# Altium schematic sheet MCU.SchDoc
size A3; SheetNumber: 2; SheetTotal: 2
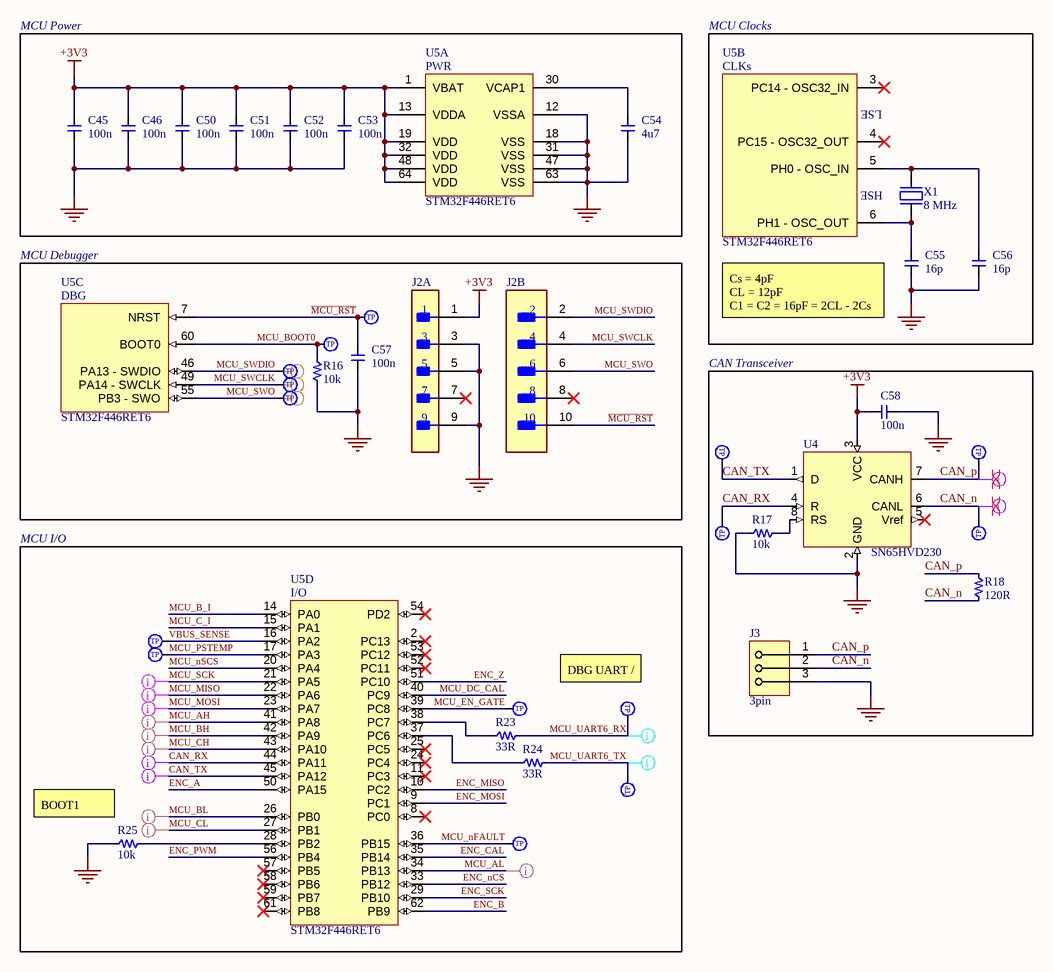
[diagram p0: MCU.SchDoc]

## Parts
C45  100n  [C0402]
C46  100n  [C0402]
C50  100n  [C0402]
C51  100n  [C0402]
C52  100n  [C0402]
C53  100n  [C0402]
C54  4u7  [C0402]
C55  16p  [C0402]
C56  16p  [C0402]
C57  100n  [C0402]
C58  100n  [C0402]
J2  FTSH-105-01-L-DV-K-TR  [FP-FTSH-105-01-L-DV-K-TR-MFG]  (value not drawn)  (parts A,B of 2)
J3  3pin  [3pin_ftp]  (no BOM)
R16  10k  [R0402]
R17  10k  [R0402]
R18  120R  [R0603]
R23  33R  [R0402]
R24  33R  [R0402]
R25  10k  [R0402]
TP14  Testing_Point_1mm  [TestingPoint_1mm]  (value not drawn)  (no BOM)
TP15  Testing_Point_1mm  [TestingPoint_1mm]  (value not drawn)  (no BOM)
TP16  Testing_Point_1mm  [TestingPoint_1mm]  (value not drawn)  (no BOM)
TP17  Testing_Point_1mm  [TestingPoint_1mm]  (value not drawn)  (no BOM)
TP18  Testing_Point_1mm  [TestingPoint_1mm]  (value not drawn)  (no BOM)
TP19  Testing_Point_1mm  [TestingPoint_1mm]  (value not drawn)  (no BOM)
TP20  Testing_Point_1mm  [TestingPoint_1mm]  (value not drawn)  (no BOM)
TP21  Testing_Point_1mm  [TestingPoint_1mm]  (value not drawn)  (no BOM)
TP22  Testing_Point_1mm  [TestingPoint_1mm]  (value not drawn)  (no BOM)
TP25  Testing_Point_1mm  [TestingPoint_1mm]  (value not drawn)  (no BOM)
TP26  Testing_Point_1mm  [TestingPoint_1mm]  (value not drawn)  (no BOM)
TP33  Testing_Point_1mm  [TestingPoint_1mm]  (value not drawn)  (no BOM)
TP34  Testing_Point_1mm  [TestingPoint_1mm]  (value not drawn)  (no BOM)
TP41  Testing_Point_1mm  [TestingPoint_1mm]  (value not drawn)  (no BOM)
TP44  Testing_Point_1mm  [TestingPoint_1mm]  (value not drawn)  (no BOM)
U4  SN65HVD230  [SOIC8_TI]
U5  STM32F446RET6  [STM32 - LQFP64]  (parts A,B,C,D of 4)
X1  8 MHz  [X_5032]

## Blocks framed on the sheet
MCU Power: C45 C46 C50-C54 U5
MCU Clocks: C55 C56 U5 X1
MCU Debugger: C57 J2 R16 TP14-TP18 U5
CAN Transceiver: C58 J3 R17 R18 TP19-TP22 U4
MCU I/O: R23-R25 TP25 TP26 TP33 TP34 TP41 TP44 U5

## Nets
+3V3: C45.2 C46.2 C50.2 C51.2 C52.2 C53.2 C58.2 J2.1 U4.3(VCC) U5.1(VBAT) U5.13(VDDA) U5.19(VDD) U5.32(VDD) U5.48(VDD) U5.64(VDD)
GND: C45.1 C46.1 C50.1 C51.1 C52.1 C53.1 C54.1 C55.1 C56.1 C57.1 C58.1 J2.3 J2.5 J2.9 J3.3 R16.2 R17.1 R25.1 U4.2(GND) U5.12(VSSA) U5.18(VSS) U5.31(VSS) U5.47(VSS) U5.63(VSS)
~{MCU_RST}: C57.2 J2.10 TP14.1 U5.7(NRST)
CAN_n: J3.2 R18.1 TP22.1 U4.6(CANL)
CAN_p: J3.1 R18.2 TP20.1 U4.7(CANH)
CAN_RX: TP21.1 U4.4(R) U5.44(PA11)
CAN_TX: TP19.1 U4.1(D) U5.45(PA12)
ENC_A: U5.50(PA15)
ENC_B: U5.62(PB9)
ENC_CAL: U5.35(PB14)
ENC_MISO: U5.10(PC2)
ENC_MOSI: U5.9(PC1)
ENC_nCS: U5.33(PB12)
ENC_PWM: U5.56(PB4)
ENC_SCK: U5.29(PB10)
ENC_Z: U5.51(PC10)
MCU_AH: U5.41(PA8)
MCU_AL: U5.34(PB13)
MCU_B_I: U5.14(PA0)
MCU_BH: U5.42(PA9)
MCU_BL: U5.26(PB0)
MCU_BOOT0: R16.1 TP15.1 U5.60(BOOT0)
MCU_C_I: U5.15(PA1)
MCU_CH: U5.43(PA10)
MCU_CL: U5.27(PB1)
MCU_DC_CAL: U5.40(PC9)
MCU_EN_GATE: TP33.1 U5.39(PC8)
MCU_MISO: U5.22(PA6)
MCU_MOSI: U5.23(PA7)
MCU_nFAULT: TP44.1 U5.36(PB15)
MCU_nSCS: U5.20(PA4)
MCU_PSTEMP: TP26.1 U5.17(PA3)
MCU_SCK: U5.21(PA5)
MCU_SWCLK: J2.4 TP17.1 U5.49(PA14_-_SWCLK)
MCU_SWDIO: J2.2 TP16.1 U5.46(PA13_-_SWDIO)
MCU_SWO: J2.6 TP18.1 U5.55(PB3_-_SWO)
MCU_UART6_RX: R23.2 TP34.1
MCU_UART6_TX: R24.2 TP41.1
VBUS_SENSE: TP25.1 U5.16(PA2)
NetC54_2: C54.2 U5.30(VCAP1)
NetC55_2: C55.2 U5.6(PH1_-_OSC_OUT) X1.1
NetC56_2: C56.2 U5.5(PH0_-_OSC_IN) X1.2
NetR17_2: R17.2 U4.8(RS)
NetR23_1: R23.1 U5.38(PC7)
NetR24_1: R24.1 U5.37(PC6)
NetR25_2: R25.2 U5.28(PB2)

Not connected (* = marked no-connect by the designer): J2 7* 8*; U4 5(Vref)*; U5 2(PC13)* 3(PC14_-_OSC32_IN)* 4(PC15_-_OSC32_OUT)* 8(PC0)* 11(PC3)* 24(PC4)* 25(PC5)* 52(PC11)* 53(PC12)* 54(PD2)* 57(PB5)* 58(PB6)* 59(PB7)* 61(PB8)*

## Layout directives
net class SPI: MCU_MISO, MCU_MOSI, MCU_SCK
net class CAN: CAN_n, CAN_p, CAN_RX, CAN_TX
net class UART: MCU_UART6_RX, MCU_UART6_TX
net class SWD: MCU_SWCLK, MCU_SWDIO, MCU_SWO
differential pair: CAN_n, CAN_p
net class GATE_S: MCU_AH, MCU_AL, MCU_BH, MCU_BL, MCU_CH, MCU_CL

## Notes on the sheet
- Cs = 4pF
  CL = 12pF
  C1 = C2 = 16pF = 2CL - 2Cs
- DBG UART / I2C / GPIO
- (near R25) BOOT1
- PROJECT
- PCB Revision:
- SIZE
- FILE NAME
- SHEET
- Guim Pedrero
  Electronics Design Engineer
- DATE
- A3
- (in symbol STM32F446RET6, part A) PWR
- (in symbol STM32F446RET6, part B) CLKs; LSE; HSE
- (in symbol STM32F446RET6, part C) DBG
- (in symbol STM32F446RET6, part D) I/O
- (in symbol Testing_Point_1mm) TP

## Library data of the parts
C45 C46 C50-C58 = C_0402: 0402 cap
  C45 C46 C50-C53 C57 C58: LCSC: C307331
  C54: LCSC: C23733
  C55 C56: LCSC: C77590
J2 = CMP-2000-06293-2: CONN HEADER SMD 10POS 1.27MM; Max Current Rating: 1.75A; Number of Contacts: 10; Gender: Male; Row Spacing: 0.05inch; Connector Type: Male Pin; Housing Color: Black; Min Operating Temperature: -55°C; Depth: 3.43mm; Color: Black; Contact Plating: Gold; REACH SVHC: No SVHC; Packaging: Tape and Reel; Current Rating: 1.75A; Radiation Hardening: No; Package Quantity: 550; Number of Positions: 10; Max Operating Temperature: 125°C; Orientation: Straight; Termination: Solder; Contact Mating Length: 0.12inch; Number of Rows: 2; Lead Free: Lead Free; Contact Material: Bronze; Mount: Surface Mount; Housing Material: Polymer; Pitch: 1.27mm; Length: 6.35mm; LCSC: C448647
J3 = 3pin_ftp
R16 R17 R23-R25 = R_0402: 0402 62.5mW
  R16 R17 R25: LCSC: C25744
  R23 R24: LCSC: C25105
R18 = R_0603: 0603 100mW; LCSC: C22787
TP14-TP22 TP25 TP26 TP33 TP34 TP41 TP44 = Testing_Point_1mm: 1mm testing point
U4 = SN65HVD230DR: Interface Circuit, 1-Trnsvr, BICMOS, PDSO8; Manufacturer: Texas Instruments; Package Body Material: Plastic; Data Rate: 1000Mbps; Channels: 1; Package Equivalence Code: SOP8,.25; Power Supplies: 3.3V; Max Supply Current: 17uA; Qualification Status: Not Qualified; Supplier: Mouser; Supplier Part Number: 595-SN65HVD230DR; Manufacturer Part Number: SN65HVD230DR; RoHS: Yes; Category: Interface ICs; Stock: 21679; Pricing: 1=1.95, 10=1.44, 50=1.31, 100=1.17, 1000=1.03, 10000=0.967 (USD); Case/Package: SOP; Pins: 8; Package Shape: Rectangular; Terminal Finish: Nickel; Min Operating Temperature: -40°C; Max Operating Temperature: 85°C; JESD-609 Code: e4; JESD-30 Code: R-PDSO-G8; Moisture Sensitivity Level: 1; Number of Transceivers: 1; Package Style: SMALL OUTLINEMeter; Peak Reflow Temperature (Cel): 260°C; Nominal Supply Voltage: 3.3V; Surface Mount: Yes; Technology: BICMOS; Telecom IC Type: INTERFACE CIRCUIT; Terminal Form: Gull Wing; Terminal Position: DUAL; Length: 4.9mm; Width: 3.9mm; Height - Seated (Max): 1.75mm; Terminal Pitch: 1.27mm; Temperature Grade: INDUSTRIAL; Reach SVHC Compliant: Yes; RoHS Compliant: Yes; ComponentLink1URL: https://www.ti.com:443/lit/ds/symlink/sn65hvd230.pdf?src-supplier=IHS+Markit; ComponentLink1Description: https://www.ti.com:443/lit/ds/symlink/sn65hvd230.pdf?src-supplier=IHS+Markit; ComponentLink2URL: https://datasheet.ciiva.com/3303/slos346k-3303008.pdf?src-supplier=Avnet; ComponentLink2Description: https://datasheet.ciiva.com/3303/slos346k-3303008.pdf?src-supplier=Avnet; ComponentLink3URL: https://datasheet.ciiva.com/28652/1695240-28652369.pdf?src-supplier=Element14; ComponentLink3Description: https://datasheet.ciiva.com/28652/1695240-28652369.pdf?src-supplier=Element14; ComponentLink4URL: https://datasheet.ciiva.com/4781/sn65hvd230-86923-4781328.pdf?src-supplier=Mouser; ComponentLink4Description: https://datasheet.ciiva.com/4781/sn65hvd230-86923-4781328.pdf?src-supplier=Mouser; ComponentLink5URL: https://datasheet.ciiva.com/27052/1495682-27052294.pdf?src-supplier=Jameco; ComponentLink5Description: https://datasheet.ciiva.com/27052/1495682-27052294.pdf?src-supplier=Jameco; ComponentLink6URL: https://datasheet.ciiva.com/22694/1887486-22694362.pdf?src-supplier=Element14; ComponentLink6Description: https://datasheet.ciiva.com/22694/1887486-22694362.pdf?src-supplier=Element14; ComponentLink7URL: https://datasheet.ciiva.com/1705/sn65hvd230-1705286.pdf?src-supplier=Digikey; ComponentLink7Description: https://datasheet.ciiva.com/1705/sn65hvd230-1705286.pdf?src-supplier=Digikey; ComponentLink8URL: https://datasheet.ciiva.com/1705/sn65hvd230-1705287.pdf?src-supplier=Digikey; ComponentLink8Description: https://datasheet.ciiva.com/1705/sn65hvd230-1705287.pdf?src-supplier=Digikey; ComponentLink9URL: https://datasheet.ciiva.com/1705/sn65hvd230-1705288.pdf?src-supplier=Digikey; ComponentLink9Description: https://datasheet.ciiva.com/1705/sn65hvd230-1705288.pdf?src-supplier=Digikey; ComponentLink10URL: https://datasheet.ciiva.com/15150/getdatasheetpartid-393721-15150028.pdf?src-supplier=Verical; ComponentLink10Description: https://datasheet.ciiva.com/15150/getdatasheetpartid-393721-15150028.pdf?src-supplier=Verical; LCSC: C12084
U5 = STM32F446RET6: RISC Microcontroller, 32-Bit, FLASH, CORTEX-M4F CPU, 180MHz, CMOS, PQFP64; Manufacturer: STMicroelectronics; Package Body Material: Plastic; Package Equivalence Code: QFP64,.47SQ,20; Power Supplies: 1.8/3.3V; Speed: 180RPM; Max Supply Current: 115mA; Qualification Status: Not Qualified; Supplier 1: Mouser; Manufacturer Part Number: STM32F446RET6; RoHS: Yes; Category: Microcontrollers; Stock 1: 4750; Pricing 1: 1=12.45, 10=11.25, 50=10.54, 100=9.5, 1000=6.72, 10000=6.72 (USD); Case/Package: QFP; Pins: 64; Package Shape: Square; Min Operating Temperature: -40°C; Max Operating Temperature: 85°C; JESD-30 Code: S-PQFP-G64; Package Style: FLATPACKMeter; Surface Mount: Yes; Technology: CMOS; Terminal Form: Gull Wing; Terminal Position: QUAD; Terminal Pitch: 0.5mm; Temperature Grade: INDUSTRIAL; Reach SVHC Compliant: Yes; RoHS Compliant: Yes; ComponentLink1URL: https://datasheet.ciiva.com:443/pdfs/VipMasterIC/IC/SGST/SGST-S-A0000954157/SGST-S-A0000954273-1.pdf?src-supplier=IHS+Markit; ComponentLink1Description: https://datasheet.ciiva.com:443/pdfs/VipMasterIC/IC/SGST/SGST-S-A0000954157/SGST-S-A0000954273-1.pdf?src-supplier=IHS+Markit; ComponentLink2URL: http://www.farnell.com/datasheets/2309063.pdf?src-supplier=Farnell; ComponentLink2Description: http://www.farnell.com/datasheets/2309063.pdf?src-supplier=Farnell; ComponentLink3URL: http://www.mouser.com/ds/2/389/stm32f446mc-956216.pdf?src-supplier=Mouser; ComponentLink3Description: http://www.mouser.com/ds/2/389/stm32f446mc-956216.pdf?src-supplier=Mouser; ComponentLink4URL: http://www.st.com/content/ccc/resource/technical/document/datasheet/65/cb/75/50/53/d6/48/24/DM00141306.pdf/files/DM00141306.pdf/jcr:content/translations/en.DM00141306.pdf?src-supplier=Digi-Key; ComponentLink4Description: http://www.st.com/content/ccc/resource/technical/document/datasheet/65/cb/75/50/53/d6/48/24/DM00141306.pdf/files/DM00141306.pdf/jcr:content/translations/en.DM00141306.pdf?src-supplier=Digi-Key; ComponentLink5URL: https://datasheet.octopart.com/STM32F446RET6-STMicroelectronics-datasheet-58295083.pdf?src-supplier=Future+Electronics; ComponentLink5Description: https://datasheet.octopart.com/STM32F446RET6-STMicroelectronics-datasheet-58295083.pdf?src-supplier=Future+Electronics; ComponentLink6URL: https://datasheet.octopart.com/STM32F446RET6-STMicroelectronics-datasheet-41797127.pdf?src-supplier=Element14; ComponentLink6Description: https://datasheet.octopart.com/STM32F446RET6-STMicroelectronics-datasheet-41797127.pdf?src-supplier=Element14; ComponentLink7URL: http://www.farnell.com/datasheets/2309063.pdf?src-supplier=Newark; ComponentLink7Description: http://www.farnell.com/datasheets/2309063.pdf?src-supplier=Newark; ComponentLink8URL: http://www.farnell.com/datasheets/2309063.pdf?src-supplier=Element14; ComponentLink8Description: http://www.farnell.com/datasheets/2309063.pdf?src-supplier=Element14; ComponentLink9URL: https://datasheet.octopart.com/STM32F446RET6-STMicroelectronics-datasheet-83961502.pdf?src-supplier=SHENGYU+ELECTRONICS; ComponentLink9Description: https://datasheet.octopart.com/STM32F446RET6-STMicroelectronics-datasheet-83961502.pdf?src-supplier=SHENGYU+ELECTRONICS; Supplier Part Number 1: 511-STM32F446RET6; LCSC: C69336
X1 = ECS-80-12-30-JGN-TR: Crystals ECX-53 8.000 MHz 12 pF 5032 2 pad +/-20/30 ppm -40 +85 C 100O Max ESR; Manufacturer: ECS International; Supplier 1: Arrow Electronics; Manufacturer Part Number: ECS-80-12-30-JGN-TR; RoHS: No; Stock 1: 108; Pricing 1: 1=0.5714, 10=0.5153, 50=0.5093, 100=0.4701, 500=0.4513, 1000=0.4297 (USD); Supplier Part Number 1: ECS-80-12-30-JGN-TR; LCSC: C6548035